# EAGLE design pCog100_Wifi_Sensor_uSD_TFT (EAGLE 6.6.0)

## Sheet 1 of 4
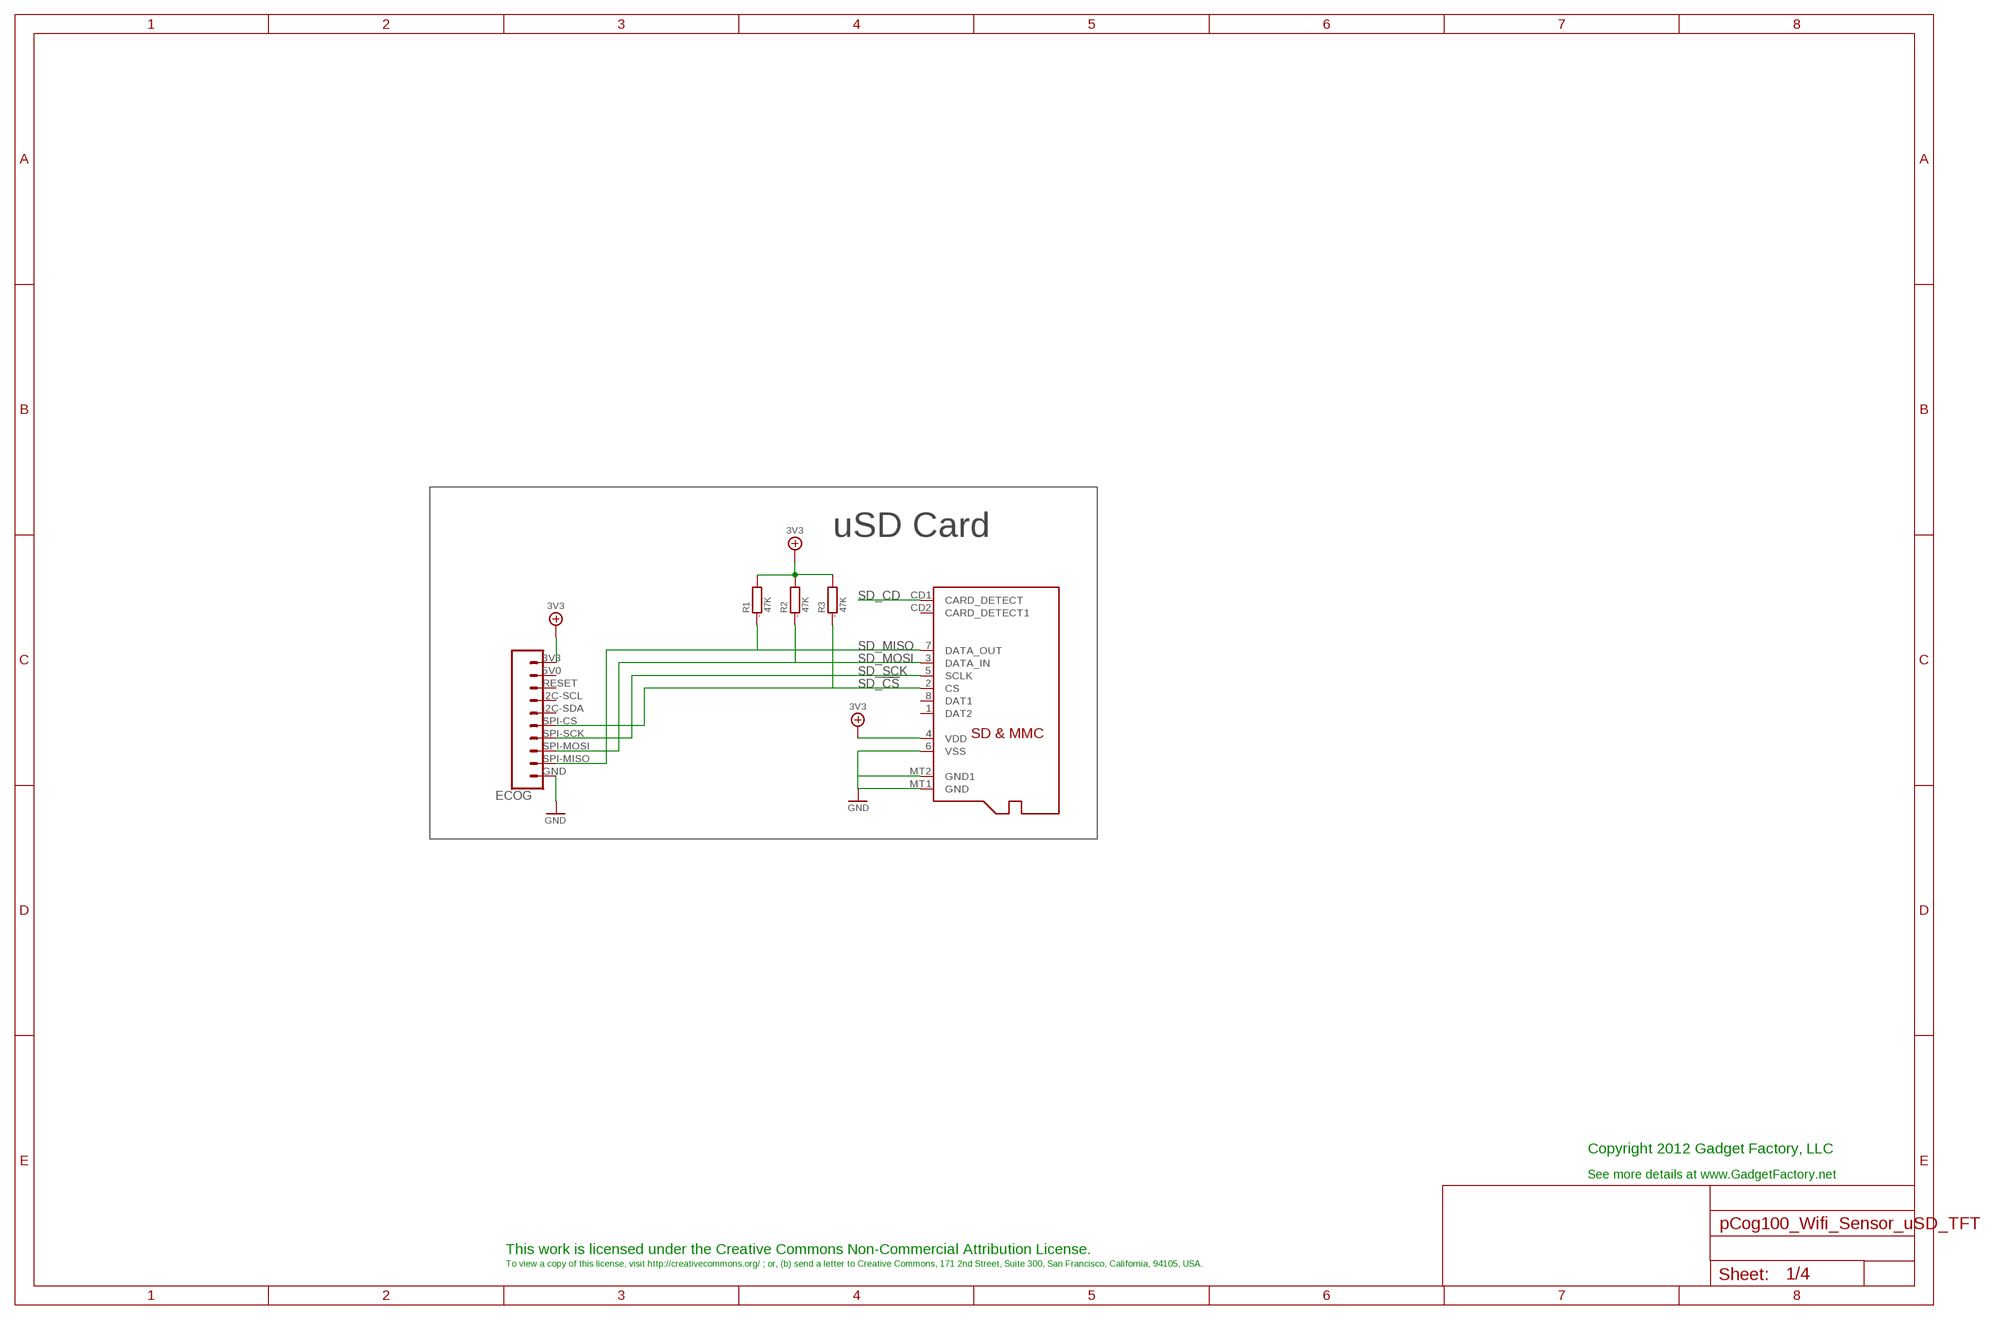
[diagram p0: schematic, sheet 1]

### Parts
ECOG  ECOG_BUSES_ROWECOG_BUSES_SMD  [ECOG_BUSES_SMD]
R1  47K  R0805  [0805]
R2  47K  R0805  [0805]
R3  47K  R0805  [0805]
SD1  MICROSD  [MICROSD]

### Nets
3V3: ECOG.3V3 R1.2 R2.2 R3.2 SD1.4(VDD) ; also sheet 2,3,4
GND: ECOG.GND SD1.6(VSS) SD1.MT1(GND) SD1.MT2(GND1) ; also sheet 2,3,4
SD_!CS: ECOG.SPI-CS R3.1 SD1.2(CS)
SD_CD: SD1.CD1(CARD_DETECT)
SD_MISO: ECOG.SPI-MISO R1.1 SD1.7(DATA_OUT)
SD_MOSI: ECOG.SPI-MOSI R2.1 SD1.3(DATA_IN)
SD_SCK: ECOG.SPI-SCK SD1.5(SCLK)
Unconnected: ECOG.5V0 ECOG.I2C-SCL ECOG.I2C-SDA ECOG.RESET SD1.1(DAT2) SD1.8(DAT1) SD1.CD2(CARD_DETECT1)

### Notes on the sheet
- uSD Card
- Copyright 2012 Gadget Factory, LLC
- See more details at www.GadgetFactory.net
- This work is licensed under the Creative Commons Non-Commercial Attribution License.
- To view a copy of this license, visit http://creativecommons.org/ ; or, (b) send a letter to Creative Commons, 171 2nd Street, Suite 300, San Francisco, California, 94105, USA.

## Sheet 2 of 4
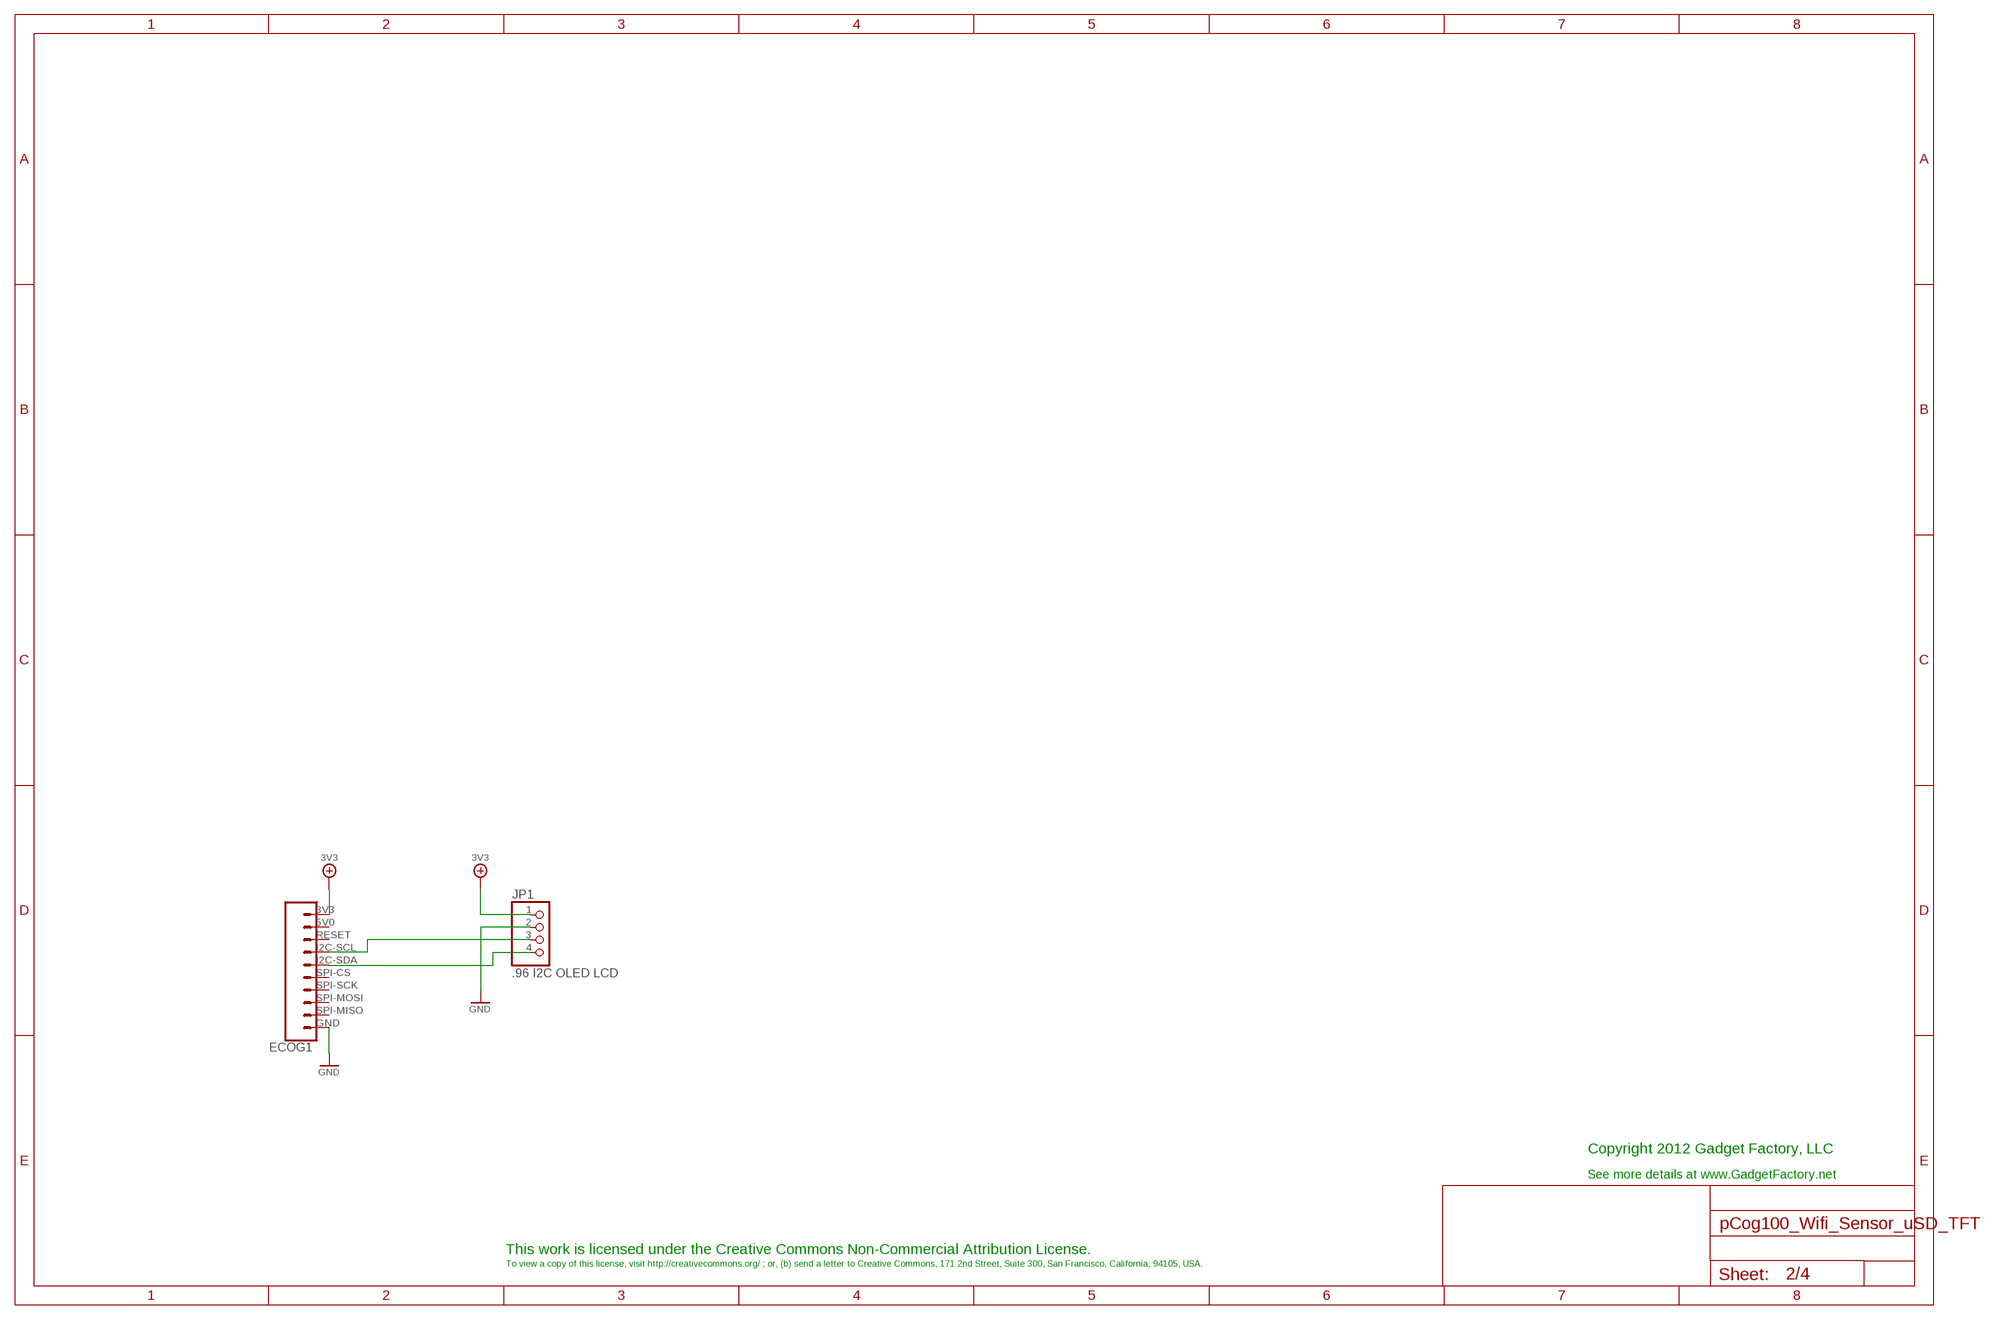
[diagram p1: schematic, sheet 2]

### Parts
ECOG1  ECOG_BUSES_ROWECOG_BUSES_SMD  [ECOG_BUSES_SMD]
JP1  .96 I2C OLED LCD  PINHD-1X4  [1X04]

### Nets
3V3: ECOG1.3V3 JP1.1 ; also sheet 1,3,4
GND: ECOG1.GND JP1.2 ; also sheet 1,3,4
N$1: ECOG1.I2C-SCL JP1.3
N$2: ECOG1.I2C-SDA JP1.4
Unconnected: ECOG1.5V0 ECOG1.RESET ECOG1.SPI-CS ECOG1.SPI-MISO ECOG1.SPI-MOSI ECOG1.SPI-SCK

### Notes on the sheet
- Copyright 2012 Gadget Factory, LLC
- See more details at www.GadgetFactory.net
- This work is licensed under the Creative Commons Non-Commercial Attribution License.
- To view a copy of this license, visit http://creativecommons.org/ ; or, (b) send a letter to Creative Commons, 171 2nd Street, Suite 300, San Francisco, California, 94105, USA.

## Sheet 3 of 4
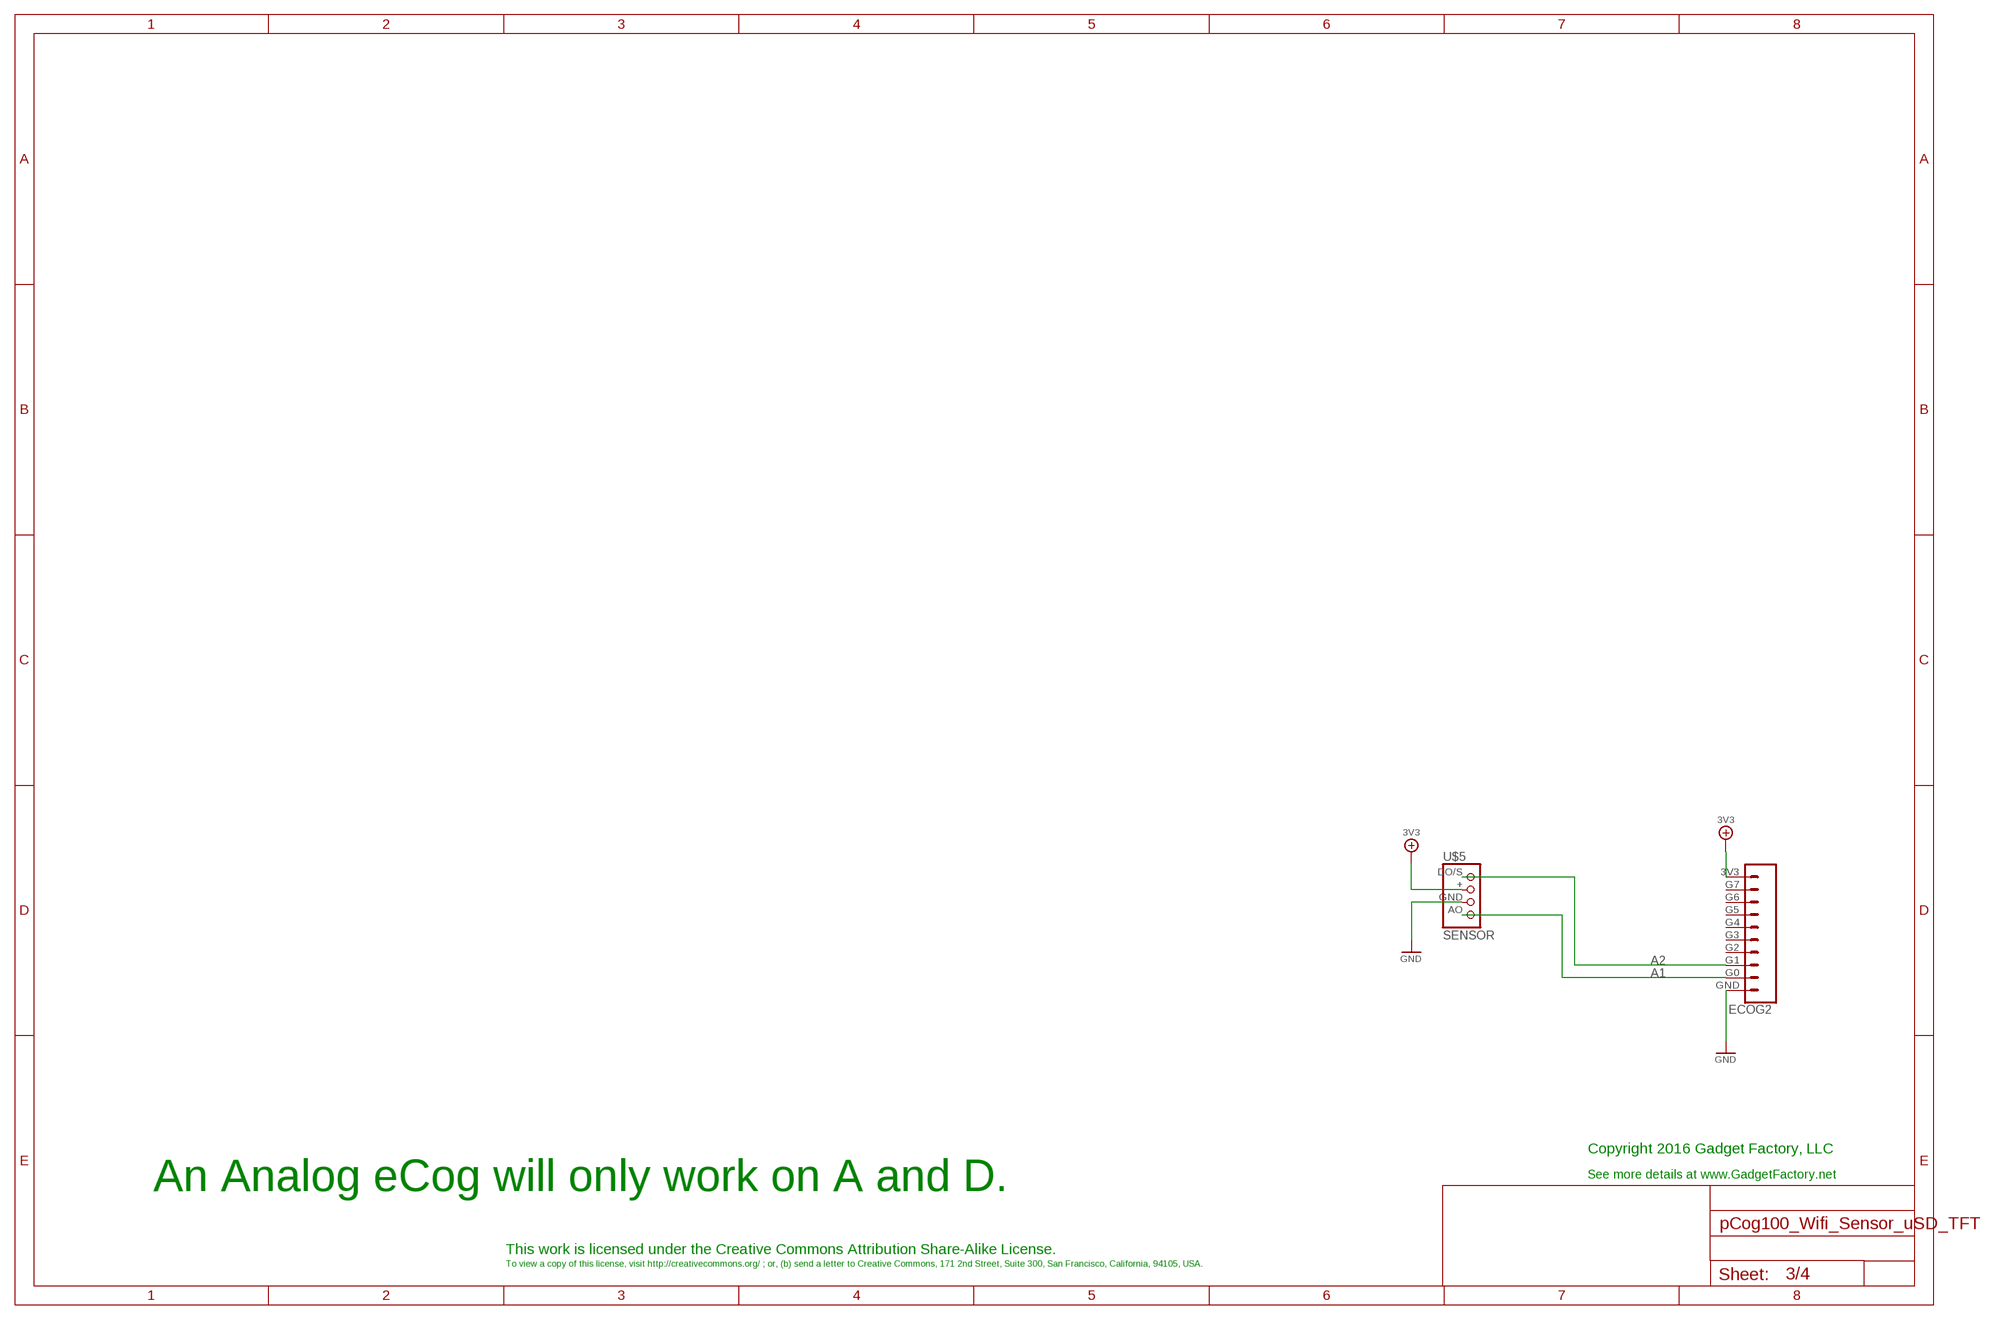
[diagram p2: schematic, sheet 3]

### Parts
ECOG2  ECOG_GENERAL_ROWECOG_GENERAL_SMD  [ECOG_GENERAL_SMD]
U$5  SENSOR  [SENSOR-HJX4]

### Nets
3V3: ECOG2.3V3 U$5.+ ; also sheet 1,2,4
A1: ECOG2.G0 U$5.AO
A2: ECOG2.G1 U$5.DO/S
GND: ECOG2.GND U$5.GND ; also sheet 1,2,4
Unconnected: ECOG2.G2 ECOG2.G3 ECOG2.G4 ECOG2.G5 ECOG2.G6 ECOG2.G7

### Notes on the sheet
- Copyright 2016 Gadget Factory, LLC
- See more details at www.GadgetFactory.net
- An Analog eCog will only work on A and D.
- This work is licensed under the Creative Commons Attribution Share-Alike License.
- To view a copy of this license, visit http://creativecommons.org/ ; or, (b) send a letter to Creative Commons, 171 2nd Street, Suite 300, San Francisco, California, 94105, USA.

## Sheet 4 of 4
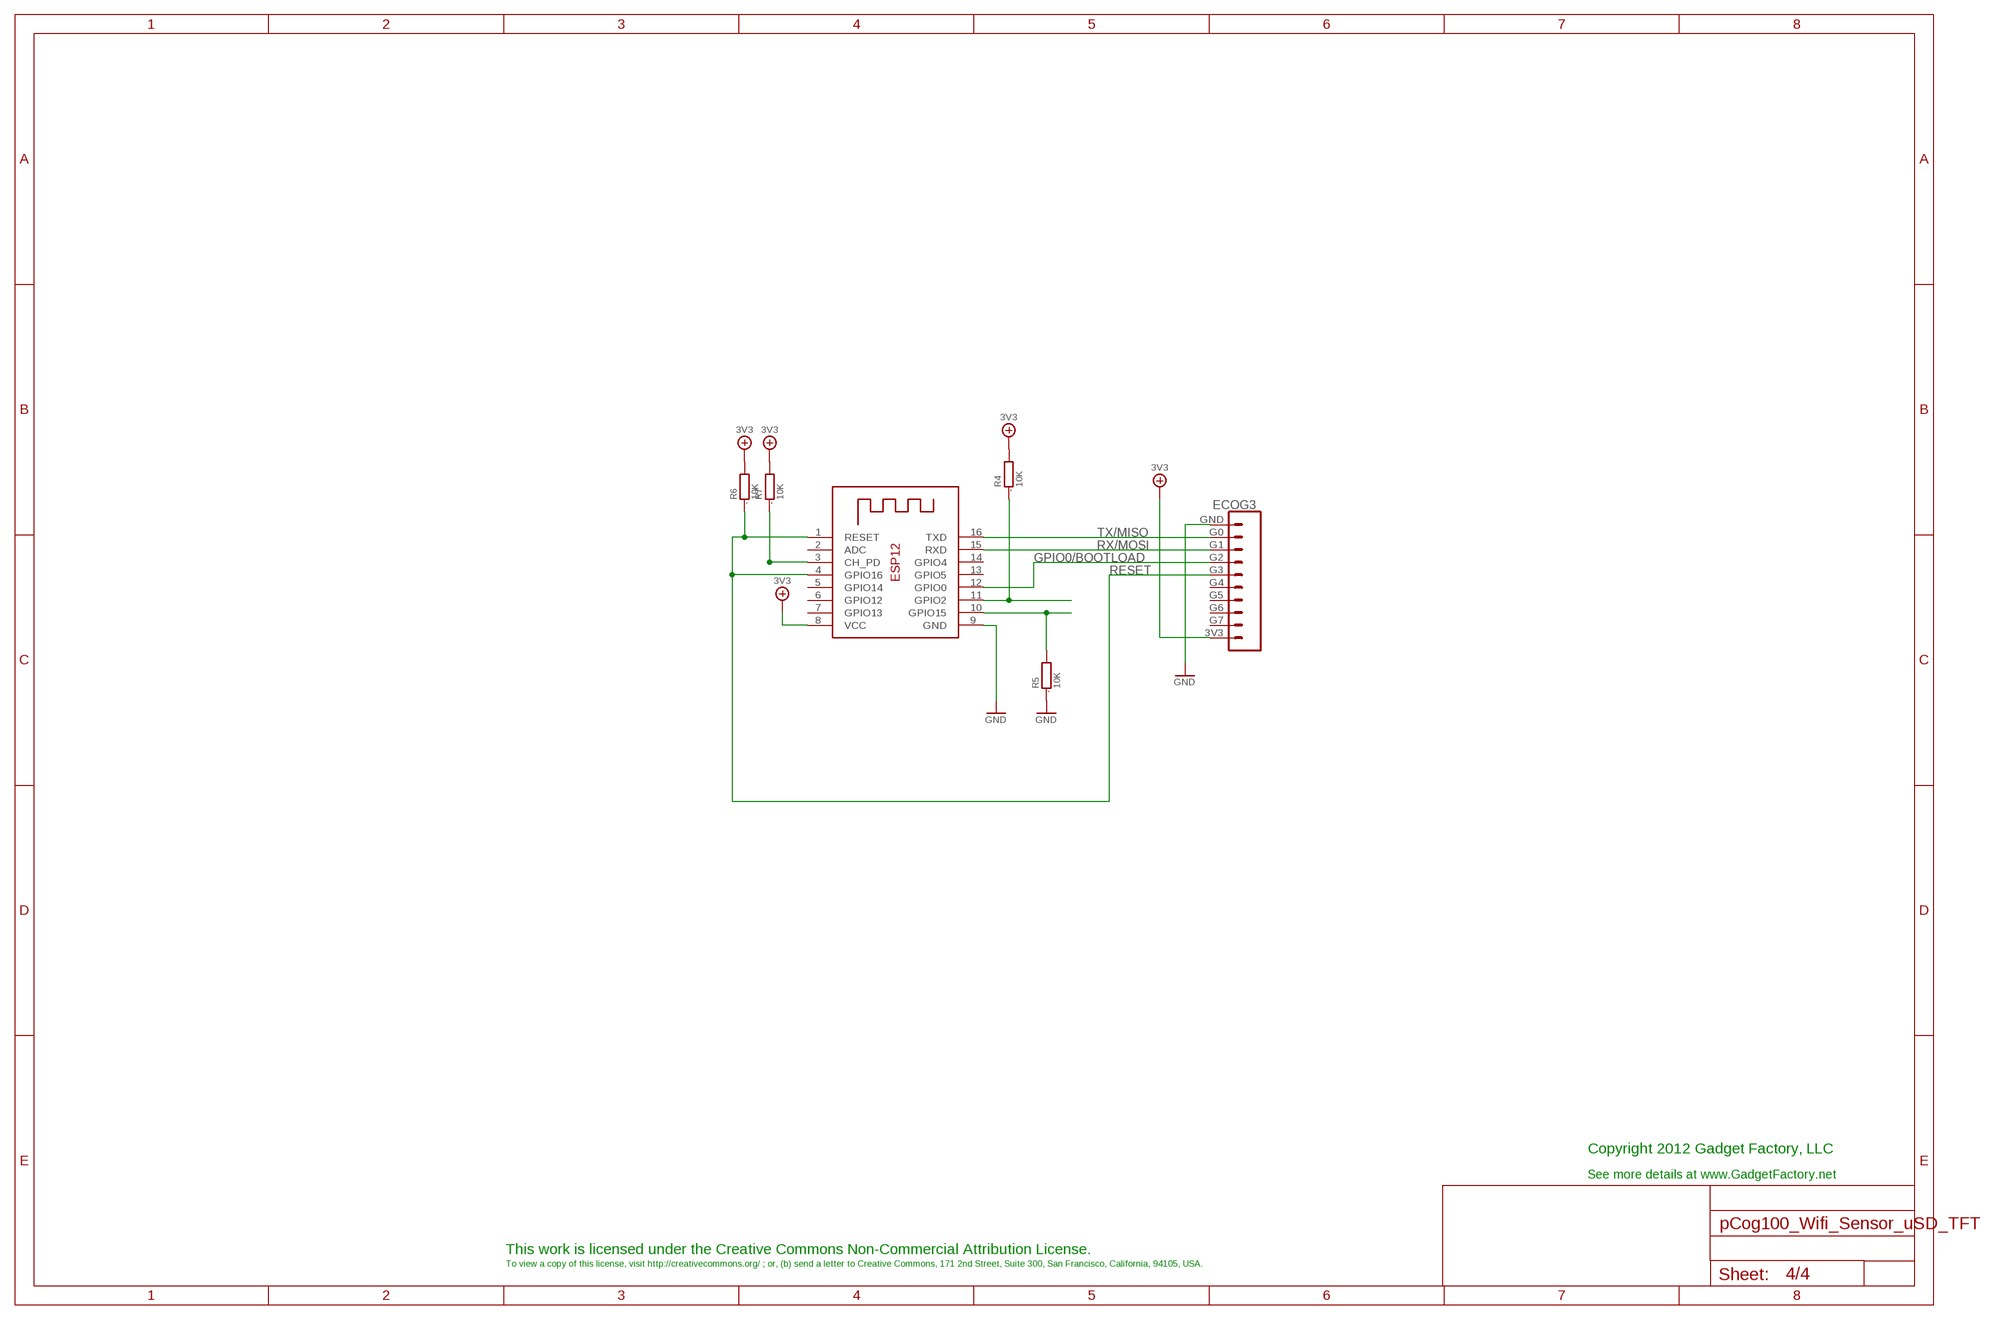
[diagram p3: schematic, sheet 4]

### Parts
ECOG3  ECOG_GENERAL_ROWECOG_GENERAL_SMD  [ECOG_GENERAL_SMD]
R4  10K  R0805  [0805]
R5  10K  R0805  [0805]
R6  10K  R0805  [0805]
R7  10K  R0805  [0805]
X1  ESP-12  [ESP-12]

### Nets
3V3: ECOG3.3V3 R4.2 R6.2 R7.2 X1.8(VCC) ; also sheet 1,2,3
GND: ECOG3.GND R5.1 X1.9(GND) ; also sheet 1,2,3
GPIO0/BOOTLOAD: ECOG3.G2 X1.12(GPIO0)
N$3: R4.1 X1.11(GPIO2)
N$4: R5.2 X1.10(GPIO15)
N$5: R7.1 X1.3(CH_PD)
RESET: ECOG3.G3 R6.1 X1.1(RESET) X1.4(GPIO16)
RX/MOSI: ECOG3.G1 X1.15(RXD)
TX/MISO: ECOG3.G0 X1.16(TXD)
Unconnected: ECOG3.G4 ECOG3.G5 ECOG3.G6 ECOG3.G7 X1.2(ADC) X1.5(GPIO14) X1.6(GPIO12) X1.7(GPIO13) X1.13(GPIO5) X1.14(GPIO4)

### Notes on the sheet
- Copyright 2012 Gadget Factory, LLC
- See more details at www.GadgetFactory.net
- This work is licensed under the Creative Commons Non-Commercial Attribution License.
- To view a copy of this license, visit http://creativecommons.org/ ; or, (b) send a letter to Creative Commons, 171 2nd Street, Suite 300, San Francisco, California, 94105, USA.

## Library data of the parts
ECOG ECOG1 = eCogs:ECOG_BUSES_ROW; DIGIKEY: S1013EC-10-ND; PARTNO: NREC010SABC-M30RC,SULLINS CONNECTOR SOLUTIONS,dk,S1013EC-10-ND,10 Positions Header Unshrouded Connector 0.100 (2.54mm) Surface Mount Tin eCog, REF78
ECOG2 ECOG3 = eCogs:ECOG_GENERAL_ROW; DIGIKEY: S1013EC-10-ND; PARTNO: NREC010SABC-M30RC,SULLINS CONNECTOR SOLUTIONS,dk,S1013EC-10-ND,10 Positions Header Unshrouded Connector 0.100 (2.54mm) Surface Mount Tin eCog, REF78
JP1 = pinhead:PINHD-1X4: PIN HEADER; DEALEXTREME: 419232; PARTNO: 346540,unknown,seeed,346540,"0.96"" 128*64 I2C Interface White Color OLED Display - http://www.dx.com/p/0-96-128x64-i2c-interface-white-color-oled-display-module-for-arduino-avr-arm-pic-346540", REF93
R1-R3 = GadgetFactory_6.0:R: RESISTOR, European symbol; DIGIKEY: RMCF0805JT47K0CT-ND; PARTNO: RMCF0805JT47K0,Stackpole Electronics Inc,DK,RMCF0805JT47K0CT-ND,RES 47K OHM 1/8W 5% 0805 SMD, REF15
R4-R7 = GadgetFactory:R: RESISTOR, European symbol; DIGIKEY: RMCF0805JT10K0CT-ND; PARTNO: RC0805JR-0710KL,YAGEO (VA),dk,311-10KARCT-ND,RES SMD 10K OHM 5% 1/8W 0805, REF63
SD1 = adafruit:MICROSD: Micro-SD / Transflash card holder with SPI pinout For the 3M # 2908-05WB-MG and/or 4UCON #19656 push-push type; DIGIKEY: 101-00660-68-6-1-ND; PARTNO: 101-00660-68-6,Amphenol,dk,101-00660-68-6-1-ND,Secure Digital  microSD Surface Mount Right Angle Gold, REF92
U$5 = eCogs:SENSOR; BOM: EXCLUDE
X1 = adafruit:ESP-12; ADAFRUIT: 2491; PARTNO: 385646,AI-Thinker,dx.com,385646,ESP8266 Serial Wi-Fi Wireless Transceiver Module - http://www.dx.com/p/esp-12e-esp8266-serial-wi-fi-wireless-transceiver-module-for-arduino-rpi-built-in-antenna-385646, REF94

## Board
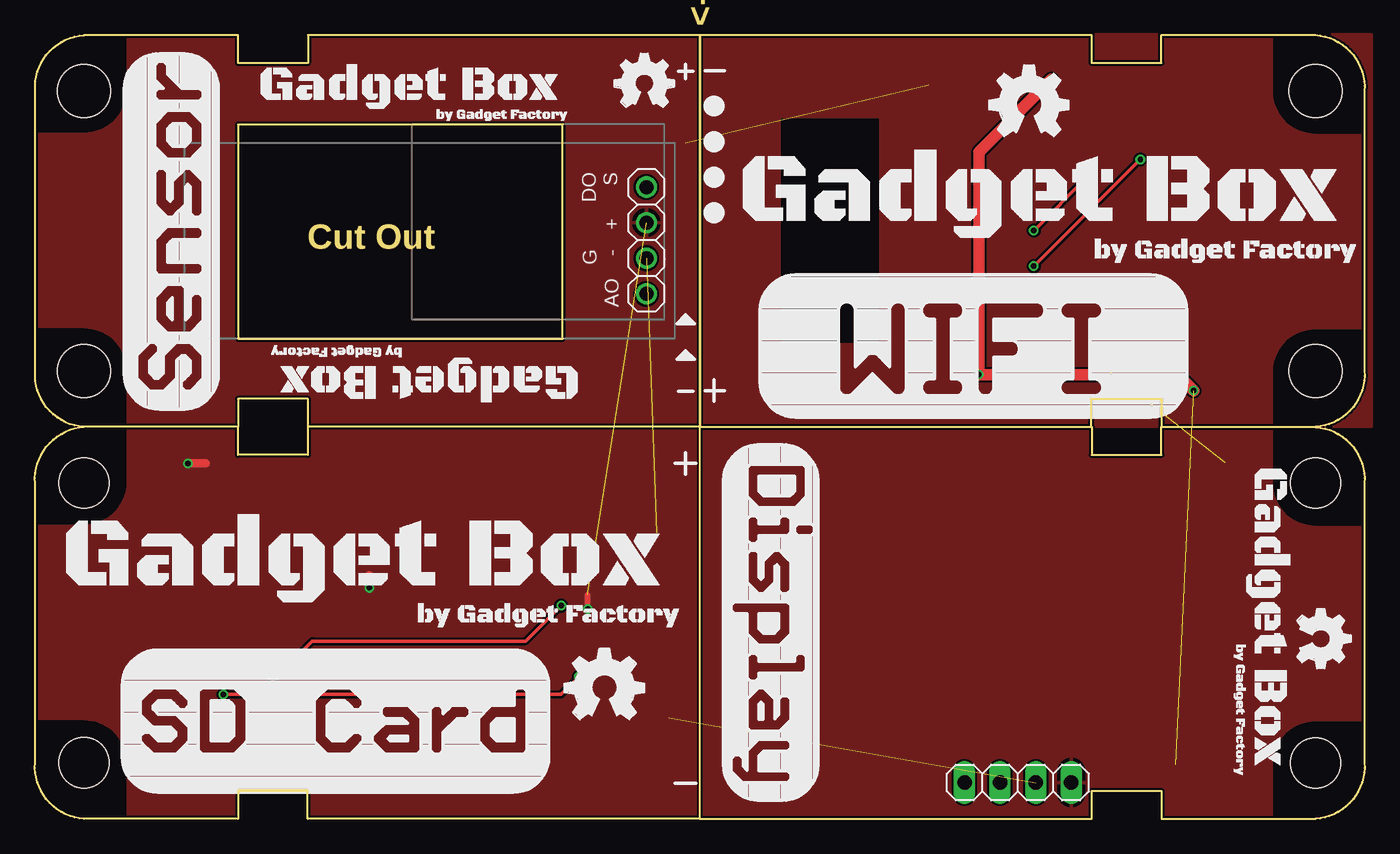
[diagram p4: board, top side]
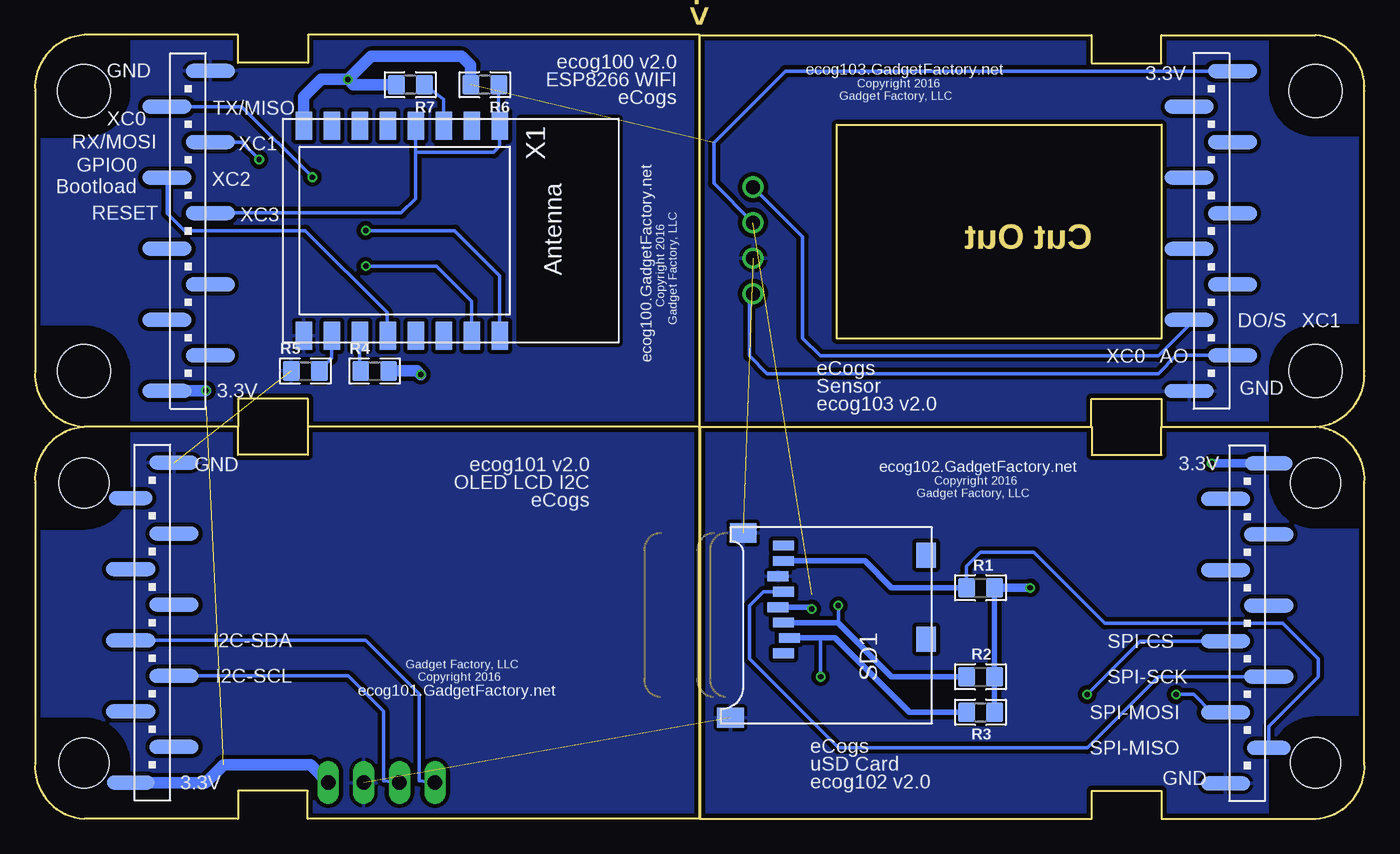
[diagram p5: board, bottom side, seen from below]

Size 95.01 x 56.01 mm. Coordinates in mm from the lower left corner, seen from the top.
Copper layers (1*16): Top 0.035mm / dielectric 1.5mm / Bottom 0.035mm
Design rules "hackvana": minimum track width 6mil, minimum drill 0.3mm, track to track 6mil, track to pad 6mil, pad to pad 6mil, via to via 6mil, smd to smd 0mil, copper to edge 6mil, drill to drill 6mil, minimum pad ring 10mil, minimum via ring 6mil, stop-mask expansion 2mil, vias tented up to drill 100mil, thermal gap 10mil

### Footprints (pad centres in the part's own frame; a part is rotated, then mirrored left to right if it is on the bottom)
ECOG_BUSES_SMD = smd 3.4 x 1 bottom: 3V3 7.337,25.4 | smd 3.5 x 1 bottom: 5V0 10.436,22.86; GND 10.436,2.54; I2C-SCL 10.436,17.78; I2C-SDA 7.337,15.24; RESET 7.337,20.32; SPI-CS 10.436,12.7; SPI-MOSI 10.436,7.62; SPI-SCK 7.337,10.16 | smd 3.1 x 1 bottom: SPI-MISO 7.337,5.08 | hole 3.6: 4.004,24.003; 4.004,4.003
ECOG_GENERAL_SMD = smd 3.5 x 1 bottom: 3V3 9.923,25.429; G0 9.923,5.111; G1 13.022,7.649; G2 9.923,10.189; G3 13.022,12.729; G4 9.923,15.269; G5 13.022,17.809; G6 9.923,20.349; G7 13.022,22.889; GND 13.022,2.571 | hole 3.8: 4,24; 4,4
1X04 = drill 1.016 long: 1 -3.81,0; 2 -1.27,0; 3 1.27,0; 4 3.81,0
0805 = smd 1.2 x 1.4: 1 -1,0; 2 1,0
MICROSD = smd 0.7 x 1.5: 1 9,-10.64; 2 7.9,-10.24; 3 6.8,-10.64; 4 5.7,-11.04; 5 4.6,-10.64; 6 3.5,-11.04; 7 2.4,-10.64; 8 1.3,-10.64 | smd 1.8 x 1.4: CD1 2,-0.44; CD2 8,-0.44 | smd 1.4 x 1.9: MT1 0.4,-13.54; MT2 13.6,-14.44
SENSOR-HJX4 = drill 1.016: + -1.29,-2.01; AO 3.79,-2.01; DO/S -3.83,-2.01; GND 1.25,-2.01
ESP-12 = smd 2 x 1.2: 1 -7.5,4.5; 2 -7.5,2.5; 3 -7.5,0.5; 4 -7.5,-1.5; 5 -7.5,-3.5; 6 -7.5,-5.5; 7 -7.5,-7.5; 8 -7.5,-9.5; 9 7.5,-9.5; 10 7.5,-7.5; 11 7.5,-5.5; 12 7.5,-3.5; 13 7.5,-1.5; 14 7.5,0.5; 15 7.5,2.5; 16 7.5,4.5

### Placement (x,y rotation side)
ECOG  -0.5,0 0 top
ECOG1  95.51,28 180 top
ECOG2  -0.49,28 0 top
ECOG3  95.51,56.01 180 top
JP1  70.24,2.6 180 top
R1  27.44,16.51 0 bottom
R2  27.44,10.16 0 bottom
R3  27.44,7.62 0 bottom
R4  70.74,32 0 bottom
R5  75.7,32 0 bottom
R6  62.87,52.45 180 bottom
R7  68.2,52.45 180 bottom
SD1  30.87,20.83 270 bottom
U$1  [GADGETBOX_TEXT]  23.51,18.42 0 top
U$2  [OSHW_FILLX200_NOTEXT]  37.86,7.11 0 top
U$3  [GADGETBOX_SMALL]  88.06,14.35 270 top
U$4  [OSHW_FILLX150_NOTEXT]  90.21,15 270 top
U$5  45.71,41.31 270 top
U$6  [LEGEND_ANALOG]  46.5,35.62 0 top
U$7  [LEGEND_ANALOG]  46.5,33.08 0 top
U$8  [GADGETBOX_SMALL]  26.82,52.26 0 top
U$9  [OSHW_FILLX150_NOTEXT]  41.42,50.86 0 top
U$10  [GADGETBOX_SMALL]  28.09,31.43 180 top
U$11  [GADGETBOX_TEXT]  71.89,44.45 0 top
U$12  [LEGEND_DIO]  48.52,43.31 180 top
U$13  [LEGEND_DIO]  48.52,45.85 180 top
U$14  [LEGEND_DIO]  48.52,48.39 180 top
U$15  [LEGEND_DIO]  48.52,50.93 180 top
U$16  [OSHW_FILLX200_NOTEXT]  68.2,48.77 0 top
X1  66.3,42.04 270 bottom

### Tracks (layer width: path | path; a pad name or v marks a point on that pad's centre or on a via)
3V3  (via drill 0.38)  (3 unrouted)
  Top 0.406: v39.5,15 39.5,16
  Top 0.61: v10.93,25.4 12.2,25.4 | v23.89,16.51 23.89,17.4
  Top 0.813: v72.65,52.83 67.44,47.62 v67.44,31.75 81.66,31.75 v82.81,30.6
  Bottom 0.254: ECOG2.3V3 41.39,53.43 46.5,48.32 46.5,45.4 U$5.+
  Bottom 0.406: R3.2 R2.2 R1.2 | SD1.4 39.63,15.13 v39.5,15
  Bottom 0.61: ECOG.3V3 v10.93,25.4 | R1.2 v23.89,16.51
  Bottom 0.813: ECOG1.3V3 82.81,2.6 81.54,3.87 75.32,3.87 JP1.1 | 75.89,49.62 X1.8 75.8,51.58 74.55,52.83 v72.65,52.83 | R7.2 72.27,52.45 v72.65,52.83 | R6.2 63.87,53.83 64.52,54.48 71,54.48 v72.65,52.83 | R4.2 67.69,32 v67.44,31.75 | v82.81,30.6 85.56,30.6 ECOG3.3V3
  pour Top: -1.77,29.27 48.77,29.27 48.77,-1.27 -1.77,-1.27
  pour Top: 96.78,-1.27 46.24,-1.27 46.24,29.27 96.78,29.27
  pour Top: -1.76,57.27 48.78,57.27 48.78,26.73 -1.76,26.73
A1
  Bottom 0.254: ECOG2.G0 13.45,33.11 14.75,31.81 42.69,31.81 43.96,33.08 43.96,37.25 U$5.AO
A2
  Bottom 0.254: ECOG2.G1 12.53,35.3 14.75,33.08 38.88,33.08 40.15,34.35 40.15,41.59 U$5.DO/S
GND  (3 unrouted)
  pour Bottom (isolate 0.305): -3.04,30.54 50.04,30.54 50.04,-2.54 -3.04,-2.54
  pour Bottom (isolate 0.305): 98.05,-2.54 44.97,-2.54 44.97,30.54 98.05,30.54
  pour Bottom (isolate 0.305): -3.03,58.54 50.05,58.54 50.05,25.46 -3.03,25.46
  pour Bottom (isolate 0.305): 95.51,28.01 47.51,28.01 47.51,56.01 95.51,56.01
  pour Top: 95.51,28.07 47.25,28.07 47.25,56.01 95.51,56.01
GPIO0/BOOTLOAD
  Bottom 0.254: X1.12 69.85,34.59 69.85,36.19 75.7,42.03 84.33,42.03 85.58,43.29 ECOG3.G2
N$1
  Bottom 0.254: ECOG1.I2C-SCL 72.65,10.22 70.11,7.68 70.11,2.73 JP1.3
N$2
  Bottom 0.254: ECOG1.I2C-SDA 71.38,12.76 67.57,8.95 67.57,2.73 JP1.4
N$3
  Bottom 0.254: X1.11 71.8,32.06 R4.1
N$4
  Bottom 0.254: X1.10 73.8,32.9 R5.2
N$5
  Bottom 0.254: X1.3 65.8,51.42 R7.1
RESET
  Bottom 0.254: 67.82,47.62 67.82,49.51 X1.4 | R6.1 61.87,49.61 X1.1 61.8,48.06 62.23,47.62 67.82,47.62 | 67.82,47.62 67.82,44.32 68.84,43.3 82.46,43.3 ECOG3.G3
RX/MOSI  (via drill 0.38)
  Top 0.254: v79,47.11 v71.38,39.49
  Bottom 0.254: 63.76,34.49 X1.15 63.8,36.99 66.3,39.49 v71.38,39.49 | ECOG3.G1 80.24,48.36 v79,47.11
SD_!CS  (via drill 0.38)
  Top 0.254: v19.82,8.89 37.6,8.89 v38.87,10.16
  Bottom 0.254: v38.87,10.16 38.87,12.93 | ECOG.SPI-CS 16.01,12.7 v19.82,8.89
  Bottom 0.406: SD1.2 38.87,12.93 37.83,12.93 32.52,7.62 R3.1
SD_MISO
  Bottom 0.254: 28.71,16.78 R1.1 28.44,18.05 27.44,19.05 23.63,19.05 18.55,13.97 5.85,13.97 3.31,11.43 3.31,10.16 6.84,6.63 ECOG.SPI-MISO
  Bottom 0.406: SD1.7 35.71,18.43 33.79,16.51 R1.1
SD_MOSI  (via drill 0.38)
  Top 0.254: v37.6,15.24 35.06,12.7 19.82,12.7 16.01,8.89 v13.47,8.89
  Bottom 0.254: v37.6,15.24 37.6,13.97 | ECOG.SPI-MOSI 10.93,7.62 12.2,8.89 v13.47,8.89
  Bottom 0.406: SD1.3 37.66,14.03 37.6,13.97 33.79,10.16 R2.1
SD_SCK
  Bottom 0.254: SD1.5 42.97,16.23 43.95,15.24 43.95,11.43 37.6,5.08 19.82,5.08 14.74,10.16 ECOG.SPI-SCK
TX/MISO  (via drill 0.38)
  Top 0.254: v75.19,45.84 v71.38,42.03
  Bottom 0.254: 61.98,34.35 X1.16 61.8,38.8 65.03,42.03 v71.38,42.03 | ECOG3.G0 80.24,50.89 v75.19,45.84

### Text on the board
Dimension: <----vScore | Cut Out | <----vScore | vScore----> | vScore---->
bPlace: ecog100 v2.0 | GND | 3.3V | ecog103.GadgetFactory.net | ESP8266 WIFI | Copyright 2016 | eCogs | Gadget Factory, LLC | TX/MISO | XC0 | XC1 | RX/MOSI | GPIO0 / Bootload | XC2 | XC3 | RESET | Copyright 2016 | XC1 | DO/S | Gadget Factory, LLC | AO | XC0 | ecog100.GadgetFactory.net | eCogs | 3.3V | GND | Sensor | ecog103 v2.0 | ecog101 v2.0 | GND | 3.3V | ecog102.GadgetFactory.net | OLED LCD I2C | Copyright 2016 | Gadget Factory, LLC | eCogs | I2C-SDA | SPI-CS | Gadget Factory, LLC | I2C-SCL | SPI-SCK | ecog101.GadgetFactory.net | Copyright 2016 | SPI-MOSI | SPI-MISO | eCogs | uSD Card | 3.3V | GND | ecog102 v2.0